# Altium schematic sheet pca10156_sheet6_power_supply.SchDoc: =BoardTitle+' - Power Supply'
size A3; Organization: Nordic Semiconductor; DocumentNumber: 6; SheetNumber: 6; SheetTotal: 7; CompanyName: Nordic Semiconductor; DocumentSize: A4
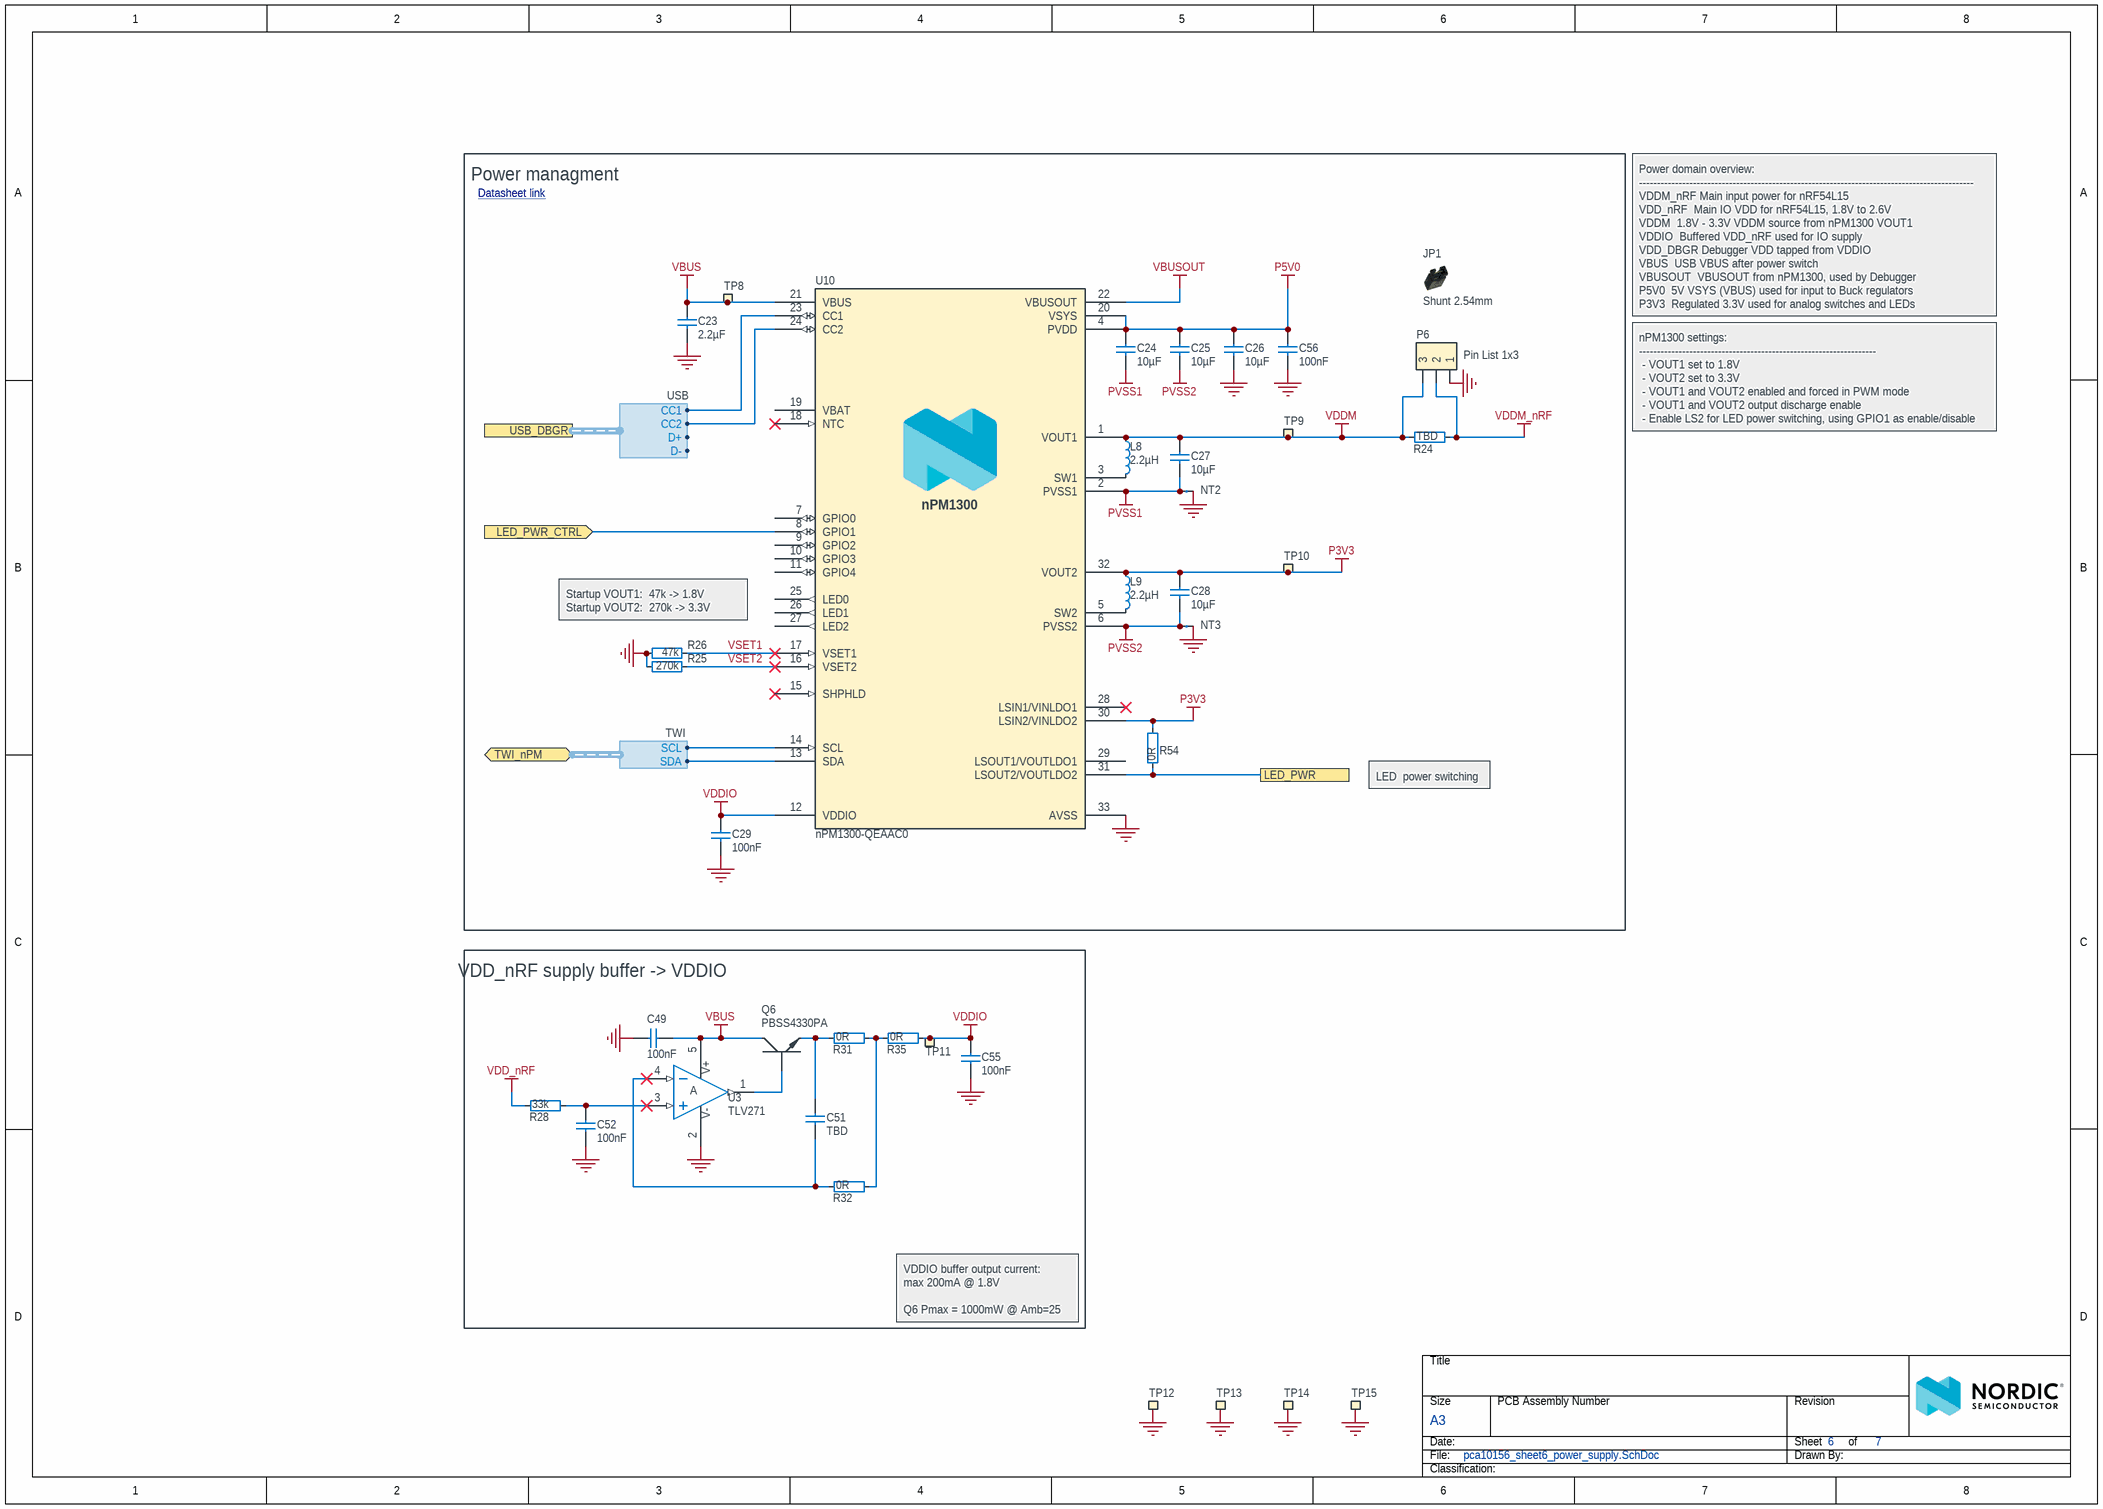
[diagram p0: pca10156_sheet6_power_supply.SchDoc]

## Parts
C23  2.2µF  [CAPC1005X04L]
C24  10µF  [CAPC1608X06L]
C25  10µF  [CAPC1608X06L]
C26  10µF  [CAPC1608X06L]
C27  10µF  [CAPC1608X06L]
C28  10µF  [CAPC1608X06L]
C29  100nF  [CAPC0603X03L_C]
C49  100nF  [CAPC0603X03L_C]
C51  TBD  [CAPC0603X03L_C]
C52  100nF  [CAPC0603X03L_C]
C55  100nF  [CAPC0603X03L_C]
C56  100nF  [CAPC0603X03L_C]
JP1  Shunt 2.54mm  [Shunt_2.54mm_Vertical]
L8  2.2µH  [INDC2016X10N]
L9  2.2µH  [INDC2016X10N]
NT2  Net tie  [2 PIN STARPOINT]  (value not drawn)  (net tie, no BOM)
NT3  Net tie  [2 PIN STARPOINT]  (value not drawn)  (net tie, no BOM)
P6  Pin List 1x3  [LIST_1x3_SMD]
Q6  PBSS4330PA  [DFN105P200X65-3N_v2]
R24  TBD  [RESC1005X04L]
R25  270k  [RESC0603X03L_C]
R26  47k  [RESC0603X03L_C]
R28  33k  [RESC0603X03L_C]
R31  0R  [RESC0603X03L_C]
R32  0R  [RESC0603X03L_C]
R35  0R  [RESC0603X03L_C]
R54  0R  [RESC0603X03L_C]
TP8  Ø1.5mm,SMD  [TP_SMD_D1.5mm]  (value not drawn)  (no BOM)
TP9  Ø1.5mm,SMD  [TP_SMD_D1.5mm]  (value not drawn)  (no BOM)
TP10  Ø1.5mm,SMD  [TP_SMD_D1.5mm]  (value not drawn)  (no BOM)
TP11  Ø1.5mm,SMD  [TP_SMD_D1.5mm]  (value not drawn)  (no BOM)
TP12  Ø1.5mm,SMD  [TP_SMD_D1.5mm]  (value not drawn)  (no BOM)
TP13  Ø1.5mm,SMD  [TP_SMD_D1.5mm]  (value not drawn)  (no BOM)
TP14  Ø1.5mm,SMD  [TP_SMD_D1.5mm]  (value not drawn)  (no BOM)
TP15  Ø1.5mm,SMD  [TP_SMD_D1.5mm]  (value not drawn)  (no BOM)
U3  TLV271  [SOT95P280X145-5N]
U10  nPM1300-QEAAC0  [Nordic_QFN50P500X500X90-33N]

## Blocks framed on the sheet
Power managment: C23-C29 C56 JP1 L8 L9 NT2 NT3 P6 R24-R26 R54 TP8-TP10 U10
VDD_nRF supply buffer -> VDDIO: C49 C51 C52 C55 Q6 R28 R31 R32 R35 TP11 U3

## Ports
LED_PWR, LED_PWR_CTRL (in), TWI_nPM (bidir, harness TWI), USB_DBGR (harness USB)

## Harnesses
TWI: SDA, SCL
USB: D+, D-, CC1, CC2

## Nets
GND: C23.1 C26.1 C29.2 C49.2 C52.2 C55.2 C56.1 NT2.1 NT3.1 P6.1 R25.2 R26.2 TP12.1 TP13.1 TP14.1 TP15.1 U3.2(VSS) U10.33(AVSS)
P3V3: C28.2 L9.1 R54.2 TP10.1 U10.30(LSIN2/VINLDO2) U10.32(VOUT2)
P5V0: C24.2 C25.2 C26.2 C56.2 U10.4(PVDD) U10.20(VSYS)
PVSS1: C24.1 C27.1 NT2.2 U10.2(PVSS1)
PVSS2: C25.1 C28.1 NT3.2 U10.6(PVSS2)
VBUS: C23.2 C49.1 Q6.3(C) TP8.1 U3.5(VDD) U10.21(VBUS)
VBUSOUT: U10.22(VBUSOUT)
VDD_nRF: R28.1
VDDIO: C29.1 C55.1 R35.2 TP11.1 U10.12(VDDIO)
VDDM: C27.2 L8.1 P6.3 R24.2 TP9.1 U10.1(VOUT1)
VDDM_nRF: P6.2 R24.1
LED_PWR: R54.1 U10.31(LSOUT2/VOUTLDO2) ; port LED_PWR
LED_PWR_CTRL: U10.8(GPIO1) ; port LED_PWR_CTRL
VSET1: R26.1 U10.17(VSET1)
VSET2: R25.1 U10.16(VSET2)
NetC51_1: C51.1 R32.1 U3.4(IN-)
NetC51_2: C51.2 Q6.2(E) R31.1
NetC52_1: C52.1 R28.2 U3.3(IN+)
NetL8_2: L8.2 U10.3(SW1)
NetL9_2: L9.2 U10.5(SW2)
NetQ6_1: Q6.1(B) U3.1(OUT)
NetR31_2: R31.2 R32.2 R35.1
NetU10_13: U10.13(SDA) ; port TWI_nPM.SDA
NetU10_14: U10.14(SCL) ; port TWI_nPM.SCL
NetU10_23: U10.23(CC1) ; port USB_DBGR.CC1
NetU10_24: U10.24(CC2) ; port USB_DBGR.CC2

Not connected (* = marked no-connect by the designer): U10 7(GPIO0) 9(GPIO2) 10(GPIO3) 11(GPIO4) 15(SHPHLD)* 18(NTC)* 19(VBAT) 25(LED0) 26(LED1) 27(LED2) 28(LSIN1/VINLDO1)* 29(LSOUT1/VOUTLDO1)

## Notes on the sheet
- Datasheet link <https://infocenter.nordicsemi.com/index.jsp?topic=%2Fstruct_pmic%2Fstruct%2Fnpm1300.html>
- Power domain overview:
  ---------------------------------------------------------------------------------------------
  VDDM_nRF	Main input power for nRF54L15
  VDD_nRF		Main IO VDD for nRF54L15, 1.8V to 2.6V
  VDDM		1.8V - 3.3V VDDM source from nPM1300 VOUT1
  VDDIO		Buffered VDD_nRF used for IO supply
  VDD_DBGR	Debugger VDD tapped from VDDIO
  VBUS		USB VBUS after power switch
  VBUSOUT		VBUSOUT from nPM1300, used by Debugger
  P5V0		5V VSYS (VBUS) used for input to Buck regulators
  P3V3		Regulated 3.3V used for analog switches and LEDs
- nPM1300 settings:
  ------------------------------------------------------------------
  - VOUT1 set to 1.8V
  - VOUT2 set to 3.3V
  - VOUT1 and VOUT2 enabled and forced in PWM mode
  - VOUT1 and VOUT2 output discharge enable
  - Enable LS2 for LED power switching, using GPIO1 as enable/disable signal.
- Startup VOUT1:  47k -> 1.8V
  Startup VOUT2:  270k -> 3.3V
- LED  power switching
- VDDIO buffer output current:
  max 200mA @ 1.8V
  Q6 Pmax = 1000mW @ Amb=25
- Title
- Size
- Date:
- File:
- A3
- PCB Assembly Number
- Sheet
- Drawn By:
- Revision
- of
- Classification:
- (in symbol nPM1300-QEAAC0) nPM1300
- (in symbol TLV271CW5-7) V+; A; V-

## Library data of the parts
C23 = C0402-2µ2-10V: Capacitor, X5R, ±10%; Manufacturer: N.A.; Part number NEMS: 100200376; Component Status: Active; Pad Count: 2; Note: 10V; Part Number: C0402-2µ2-10V; PartId: 100200376; Component Class: Capacitors; Author: rsk; Manufacturer Part Number: N.A.; ComponentLink1URL: N.A.; ComponentLink1Description: Datasheet; ComponentLink2URL: N.A.; ComponentLink2Description: Supplier link; HelpURL: N.A.; LatestRevisionDate: 2020-10-13; Published: 2016-08-22; Footprint Doc: 0402; Value: 2.2µF; Supplier 1: Digi-Key; Supplier Part Number 1: 490-10451-1-ND; Supplier 2: N.A.; Supplier Part Number 2: N.A.; Artikkelnr Noca: N.A.; Part number IPS: N.A.; Part number Norautron: N.A.
C24-C28 = C0603-10µ-10V-X7T-GRM188D71A106MA73: Capacitor, X7T, ±20%, 10V; Manufacturer: Murata; Part number IPS: 00000004696; Part number NEMS: 100200414; Component Status: Active; Pad Count: 2; Note: 10VDC; Artikkelnr Noca: N.A.; Part Number: C0603-10µ-10V-X7T-GRM188D71A106MA73; PartId: 100200414; Component Class: Capacitors; Author: rsk; Manufacturer Part Number: GRM188D71A106MA73; ComponentLink1URL: N.A.; ComponentLink1Description: Datasheet; ComponentLink2URL: N.A.; ComponentLink2Description: Supplier link; HelpURL: https://no.mouser.com/datasheet/2/281/murata_03052018_GRM_Series_1-1310166.pdf; LatestRevisionDate: 2021-07-22; Published: 2018-09-11; Footprint Doc: 0603; Value: 10µF; Supplier 1: Digi-Key; Supplier Part Number 1: 490-7200-1-ND; Supplier 2: Mouser; Supplier Part Number 2: 81-GRM188D71A106MA3D; Part number Norautron: N.A.
C29 C49 C52 C55 = C0201-100n: Capacitor, X5R, ±10%; Manufacturer: N.A.; Part number IPS: 00000001248, 00000002505; Part number Norautron: 262071862; Part number NEMS: 100200078; Pad Count: 2; Note: 16V; Component Status: Active; Part Number: C0201-100n; Value: 100nF; Footprint Doc: 0201; Component Class: Capacitors; Author: rsk; PartId: 100200078; Manufacturer Part Number: N.A.; ComponentLink1URL: N.A.; ComponentLink1Description: Datasheet; ComponentLink2URL: N.A.; ComponentLink2Description: Supplier link; HelpURL: N.A.; LatestRevisionDate: 2017-11-09; Published: 2014-11-13; Supplier 1: N.A.; Supplier Part Number 1: N.A.; Supplier 2: N.A.; Supplier Part Number 2: N.A.; Artikkelnr Noca: N.A.
C51 = C0201-TBD: Chip Cap 0201; Manufacturer: N.A.; Part number NEMS: 100200002; Component Status: Active; Pad Count: 2; Assembly: Not Mounted; Part Number: C0201-TBD; PartId: 100200002; Component Class: Capacitors; Author: rsk; Manufacturer Part Number: N.A.; ComponentLink1URL: N.A.; ComponentLink1Description: Datasheet; ComponentLink2URL: N.A.; ComponentLink2Description: Supplier link; HelpURL: N.A.; LatestRevisionDate: 2014-11-13; Published: 2014-11-13; Footprint Doc: 0201; Value: TBD; Note: Chip Cap; Supplier 1: N.A.; Supplier Part Number 1: N.A.; Supplier 2: N.A.; Supplier Part Number 2: N.A.; Artikkelnr Noca: N.A.; Part number IPS: N.A.; Part number Norautron: N.A.
C56 = C0201-100n: Capacitor, X5R, ±10%; Manufacturer: N.A.; Part number IPS: 00000001248, 00000002505; Part number Norautron: 262071862; Part number NEMS: 100200078; Note: 16V; Assembly: Not Mounted; Pad Count: 2; Component Status: Active; Part Number: C0201-100n; Manufacturer Part Number: N.A.; LatestRevisionDate: 2017-11-09; Published: 2014-11-13; Value: 100nF; Artikkelnr Noca: N.A.; Footprint Doc: 0201; ComponentLink1URL: N.A.; ComponentLink1Description: Datasheet; ComponentLink2URL: N.A.; ComponentLink2Description: Supplier link; HelpURL: N.A.; Supplier 1: N.A.; Supplier Part Number 1: N.A.; Supplier 2: N.A.; Supplier Part Number 2: N.A.; Component Class: Capacitors; PartId: 100200078; Author: rsk
JP1 = SHUNT JUMPER 2.54mm Black Vertical: Shunt Jumper 2.54mm Black, open top; Manufacturer: Samtec; Manufacturer Part Number: SNT-100-BK-T; Part number NEMS: 100500728; Pad Count: 2; Note: N.A.; Component Status: Active; System: Connector; Part Number: SHUNT JUMPER 2.54mm Black Vertical; PartId: 100500752; Component Class: Connectors; Author: masi; ComponentLink1URL: N.A.; ComponentLink1Description: Datasheet; ComponentLink2URL: N.A.; ComponentLink2Description: Supplier link; HelpURL: N.A.; Footprint Doc: SHUNT JUMPER 2.54mm; LatestRevisionDate: 2022-07-01; Published: 2022-07-01; Value: Shunt 2.54mm; Supplier 1: N.A.; Supplier Part Number 1: N.A.; Supplier 2: N.A.; Supplier Part Number 2: N.A.; Artikkelnr Noca: N.A.; Part number IPS: N.A.; Part number Norautron: N.A.
L8 L9 = L0806-2µ2-2500mA-73mOhm-CIGT201610EH2R2MNE: Inductor, Irms=2.5A, Isat=2.9A, ±20%, DCR=73mΩ; Manufacturer: Samsung Electro-Mechanics America; Part number Norautron: 26521789; Part number NEMS: 100300400; Component Status: Active; Pad Count: 2; Note: Unshielded Thin Film Inductor; Artikkelnr Noca: N.A.; Part Number: L0806-2µ2-2500mA-73mOhm-CIGT201610EH2R2MNE; PartId: 100300400; Component Class: Inductors; Author: rsk; Manufacturer Part Number: CIGT201610EH2R2MNE; ComponentLink1URL: https://media.digikey.com/pdf/Data%20Sheets/Samsung%20PDFs/CIGT201610EH2R2MNE_Spec.pdf; ComponentLink1Description: Datasheet; ComponentLink2URL: https://www.digikey.com/en/products/detail/samsung-electro-mechanics/CIGT201610EH2R2MNE/7041223?s=N4IgTCBcDaIMIEkDiAVMAGAjANk%2BgogBJgBKYAsgHL4gC6AvkA; ComponentLink2Description: Supplier link; HelpURL: http://product.samsungsem.com/pi/CIGT201610EH2R2MN.do; LatestRevisionDate: 2022-09-07; Published: 2021-02-03; Footprint Doc: 0806; Value: 2.2µH; Supplier 1: Digi-Key; Supplier Part Number 1: 1276-6901-1-ND; Supplier 2: Mouser; Supplier Part Number 2: 187-CIGT201610EH2R2M; Part number IPS: N.A.
NT2 NT3 = 2 pin starpoint: Starpoint; Manufacturer: N.A.; Part number NEMS: 100500603; Pad Count: 2; Component Status: Active; System: Connector; Part Number: 2 pin starpoint; Manufacturer Part Number: N.A.; ComponentLink1URL: N.A.; ComponentLink1Description: Datasheet; ComponentLink2URL: N.A.; ComponentLink2Description: Supplier link; HelpURL: N.A.; Footprint Doc: N.A.; LatestRevisionDate: 2017-08-31; Published: 2017-08-31; Value: Net tie; Note: Net tie; Supplier 1: N.A.; Supplier Part Number 1: N.A.; Supplier 2: N.A.; Supplier Part Number 2: N.A.; Artikkelnr Noca: N.A.; Part number IPS: N.A.; Component Class: Connectors; PartId: 100500603; Author: rsk; Part number Norautron: N.A.
P6 = Pin List 1x3 SMD: Pin List 1x3, 2.54mm (100mil), SMD; Manufacturer: WCON; Manufacturer Part Number: 1125-1103S0M116CR04; Part number Norautron: 26470016; Part number NEMS: 100500306; Note: N.A.; Pad Count: 3; Component Status: Active; System: Connector; Part Number: Pin List 1x3 SMD; Footprint Doc: LIST_1x3_SMD; LatestRevisionDate: 2021-09-24; Published: 2013-10-21; Value: Pin List 1x3; Artikkelnr Noca: N.A.; ComponentLink1URL: N.A.; ComponentLink1Description: Datasheet; ComponentLink2URL: N.A.; ComponentLink2Description: Supplier link; HelpURL: N.A.; Part number IPS: N.A.; Supplier 1: Cabcon; Supplier Part Number 1: 1125-1103S0M116CR04; Supplier 2: Samtec; Supplier Part Number 2: TSM-103-01-L-SV-P-TR; Component Class: Connectors; PartId: 100500306; Author: rsk
Q6 = PBSS4330PA,115: 30V, 3A, 2.1W, G=270, NPN Transistor; Manufacturer: Nexperia; Part number NEMS: 101300184; Component Status: Active; Pad Count: 3; Note: N.A.; Part Number: PBSS4330PA,115; PartId: 101300184; Component Class: Semiconductors; Author: rubr; Manufacturer Part Number: PBSS4330PA,115; ComponentLink1URL: https://assets.nexperia.com/documents/data-sheet/PBSS4330PA.pdf; ComponentLink1Description: Datasheet; ComponentLink2URL: https://www.digikey.com/en/products/detail/nexperia-usa-inc/PBSS4330PA-115/2296330; ComponentLink2Description: Supplier link; HelpURL: https://www.nexperia.com/products/bipolar-transistors/general-purpose-and-low-vcesat-bipolar-transistors/single-bipolar-transistors/single-bipolar-transistors-100-v/PBSS4330PA.html; LatestRevisionDate: 2021-06-03; Published: 2021-06-03; Footprint Doc: HUSON-3 (2x2); Value: PBSS4330PA; Supplier 1: Digi-Key; Supplier Part Number 1: 1727-5112-1-ND‎; Supplier 2: N.A.; Supplier Part Number 2: N.A.; Artikkelnr Noca: N.A.; Part number IPS: N.A.; Part number Norautron: N.A.
R24 = R0402-TBD: Chip Res 0402; Manufacturer: N.A.; Part number NEMS: 100100282; Component Status: Active; Pad Count: 2; Assembly: Not Mounted; Part Number: R0402-TBD; PartId: 100100282; Component Class: Resistors; Author: rsk; Manufacturer Part Number: N.A.; ComponentLink1URL: N.A.; ComponentLink1Description: Datasheet; ComponentLink2URL: N.A.; ComponentLink2Description: Supplier link; HelpURL: N.A.; LatestRevisionDate: 2010-12-21; Published: 2010-12-21; Footprint Doc: 0402; Value: TBD; Note: Chip Res; Supplier 1: N.A.; Supplier Part Number 1: N.A.; Supplier 2: N.A.; Supplier Part Number 2: N.A.; Artikkelnr Noca: N.A.; Part number IPS: N.A.; Part number Norautron: N.A.
R25 = R0201-270k: Resistor, ±1%, 0.05W; Manufacturer: N.A.; Part number IPS: 00000004317; Part number NEMS: 100100086; Component Status: Active; Pad Count: 2; Note: Chip Res 1%; Part Number: R0201-270k; PartId: 100100086; Component Class: Resistors; Author: rsk; Manufacturer Part Number: N.A.; ComponentLink1URL: N.A.; ComponentLink1Description: Datasheet; ComponentLink2URL: N.A.; ComponentLink2Description: Supplier link; HelpURL: N.A.; LatestRevisionDate: 2014-11-13; Published: 2014-11-13; Footprint Doc: 0201; Value: 270k; Supplier 1: N.A.; Supplier Part Number 1: N.A.; Supplier 2: N.A.; Supplier Part Number 2: N.A.; Artikkelnr Noca: N.A.; Part number Norautron: N.A.
R26 = R0201-47k: Resistor, ±1%, 0.05W; Manufacturer: N.A.; Part number IPS: 00000001423; Part number NEMS: 100100076; Component Status: Active; Pad Count: 2; Note: Chip Res 1%; Part Number: R0201-47k; PartId: 100100076; Component Class: Resistors; Author: rsk; Manufacturer Part Number: N.A.; ComponentLink1URL: N.A.; ComponentLink1Description: Datasheet; ComponentLink2URL: N.A.; ComponentLink2Description: Supplier link; HelpURL: N.A.; LatestRevisionDate: 2014-11-13; Published: 2014-11-13; Footprint Doc: 0201; Value: 47k; Supplier 1: N.A.; Supplier Part Number 1: N.A.; Supplier 2: N.A.; Supplier Part Number 2: N.A.; Artikkelnr Noca: N.A.; Part number Norautron: N.A.
R28 = R0201-33k: Resistor, ±1%, 0.05W; Manufacturer: N.A.; Part number IPS: 00000001708; Part number NEMS: 100100073; Component Status: Active; Pad Count: 2; Note: Chip Res 1%; Part Number: R0201-33k; PartId: 100100073; Component Class: Resistors; Author: rsk; Manufacturer Part Number: N.A.; ComponentLink1URL: N.A.; ComponentLink1Description: Datasheet; ComponentLink2URL: N.A.; ComponentLink2Description: Supplier link; HelpURL: N.A.; LatestRevisionDate: 2014-11-13; Published: 2014-11-13; Footprint Doc: 0201; Value: 33k; Supplier 1: N.A.; Supplier Part Number 1: N.A.; Supplier 2: N.A.; Supplier Part Number 2: N.A.; Artikkelnr Noca: N.A.; Part number Norautron: N.A.
R31 R32 R35 = R0201-0R: Resistor, ±5%, 0.05W; Manufacturer: N.A.; Part number IPS: 00000003245; Part number NEMS: 100100001; Component Status: Active; Pad Count: 2; Note: Chip Res 5%; Part Number: R0201-0R; PartId: 100100001; Component Class: Resistors; Author: rsk; Manufacturer Part Number: N.A.; ComponentLink1URL: N.A.; ComponentLink1Description: Datasheet; ComponentLink2URL: N.A.; ComponentLink2Description: Supplier link; HelpURL: N.A.; LatestRevisionDate: 2017-11-09; Published: 2014-11-13; Footprint Doc: 0201; Value: 0R; Supplier 1: N.A.; Supplier Part Number 1: N.A.; Supplier 2: N.A.; Supplier Part Number 2: N.A.; Artikkelnr Noca: N.A.; Part number Norautron: N.A.
R54 = R0201-0R: Resistor, ±5%, 0.05W; Manufacturer: N.A.; Part number IPS: 00000003245; Part number NEMS: 100100001; Component Status: Active; Pad Count: 2; Note: Chip Res 5%; Assembly: Not Mounted; Part Number: R0201-0R; PartId: 100100001; Component Class: Resistors; Author: rsk; Manufacturer Part Number: N.A.; ComponentLink1URL: N.A.; ComponentLink1Description: Datasheet; ComponentLink2URL: N.A.; ComponentLink2Description: Supplier link; HelpURL: N.A.; LatestRevisionDate: 2017-11-09; Published: 2014-11-13; Footprint Doc: 0201; Value: 0R; Supplier 1: N.A.; Supplier Part Number 1: N.A.; Supplier 2: N.A.; Supplier Part Number 2: N.A.; Artikkelnr Noca: N.A.; Part number Norautron: N.A.
TP8-TP15 = TP_SMD_Ø1.5MM: 1.5mm circular SMD testpad; Manufacturer: Nordic Semiconductor; Manufacturer Part Number: N.A.; Part number NEMS: 100500477; Pad Count: 1; Component Status: Active; Part Number: TP_SMD_Ø1.5MM; ComponentLink1URL: N.A.; ComponentLink1Description: Datasheet; ComponentLink2URL: N.A.; ComponentLink2Description: Supplier link; HelpURL: N.A.; Footprint Doc: TP_SMD_Ø1.5mm; LatestRevisionDate: 2021-03-05; Published: 2016-06-02; Value: Ø1.5mm,SMD; Note: N.A.; Supplier 1: N.A.; Supplier Part Number 1: N.A.; Supplier 2: N.A.; Supplier Part Number 2: N.A.; Artikkelnr Noca: N.A.; Part number IPS: N.A.; Component Class: Connectors; PartId: 100500477; Author: rsk; Part number Norautron: N.A.
U3 = TLV271CW5-7: Dual rail to rail CMOS Amplifier; Manufacturer: Diodes Incorporated; Part number NEMS: 101900398; Component Status: Active; Pad Count: 5; Note: N.A.; Part Number: TLV271CW5-7; PartId: 101900398; Component Class: Misc_ICs; Author: rsk; Manufacturer Part Number: TLV271CW5-7; ComponentLink1URL: N.A.; ComponentLink1Description: Datasheet; ComponentLink2URL: N.A.; ComponentLink2Description: Supplier link; HelpURL: http://www.diodes.com/_files/datasheets/TLV27x.pdf; LatestRevisionDate: 2016-04-05; Published: 2016-04-05; Footprint Doc: SOT-25; Value: TLV271; Supplier 1: Digi-Key; Supplier Part Number 1: TLV271CW5-7DICT-ND; Supplier 2: N.A.; Supplier Part Number 2: N.A.; Artikkelnr Noca: N.A.; Part number IPS: N.A.; Part number Norautron: N.A.
U10 = nPM1300-QEAAC0: Li-Ion/Li-Polymer USB-C battery charger with high efficiency buck regulators, LDOs or load switches, LED drivers, TWI and VBUSOUT; Manufacturer: Nordic Semiconductor; Part number NEMS: 102000306; Component Status: Active; Pad Count: 33; Note: Production version; Artikkelnr Noca: N.A.; Part Number: nPM1300-QEAAC0; PartId: 102000306; Component Class: Nordic_Devices; Author: eisk; Manufacturer Part Number: nPM1300-QEAAC0; ComponentLink1URL: N.A.; ComponentLink1Description: Datasheet; ComponentLink2URL: N.A.; ComponentLink2Description: Supplier link; HelpURL: N.A.; LatestRevisionDate: 2023-08-16; Published: 2023-08-16; Footprint Doc: QFN-32; Value: nPM1300-QEAAC0; Supplier 1: Nordic Semiconductor; Supplier Part Number 1: nPM1300-QEAAC0; Supplier 2: N.A.; Supplier Part Number 2: N.A.; Part number IPS: N.A.; Part number Norautron: N.A.